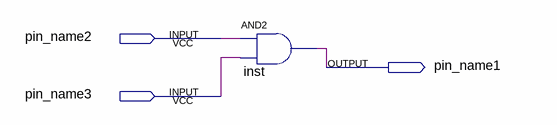
[diagram p0: schematic sheet]
// Quartus schematic SimpleAnd.bdf as structural Verilog: 1 symbols, 3 pins
module SimpleAnd (
  input  pin_name2,
  input  pin_name3,
  output pin_name1
);

  and inst (pin_name1, pin_name2, pin_name3);
endmodule
